# Altium project ECUV2.PrjPcb (part 1 of 3)
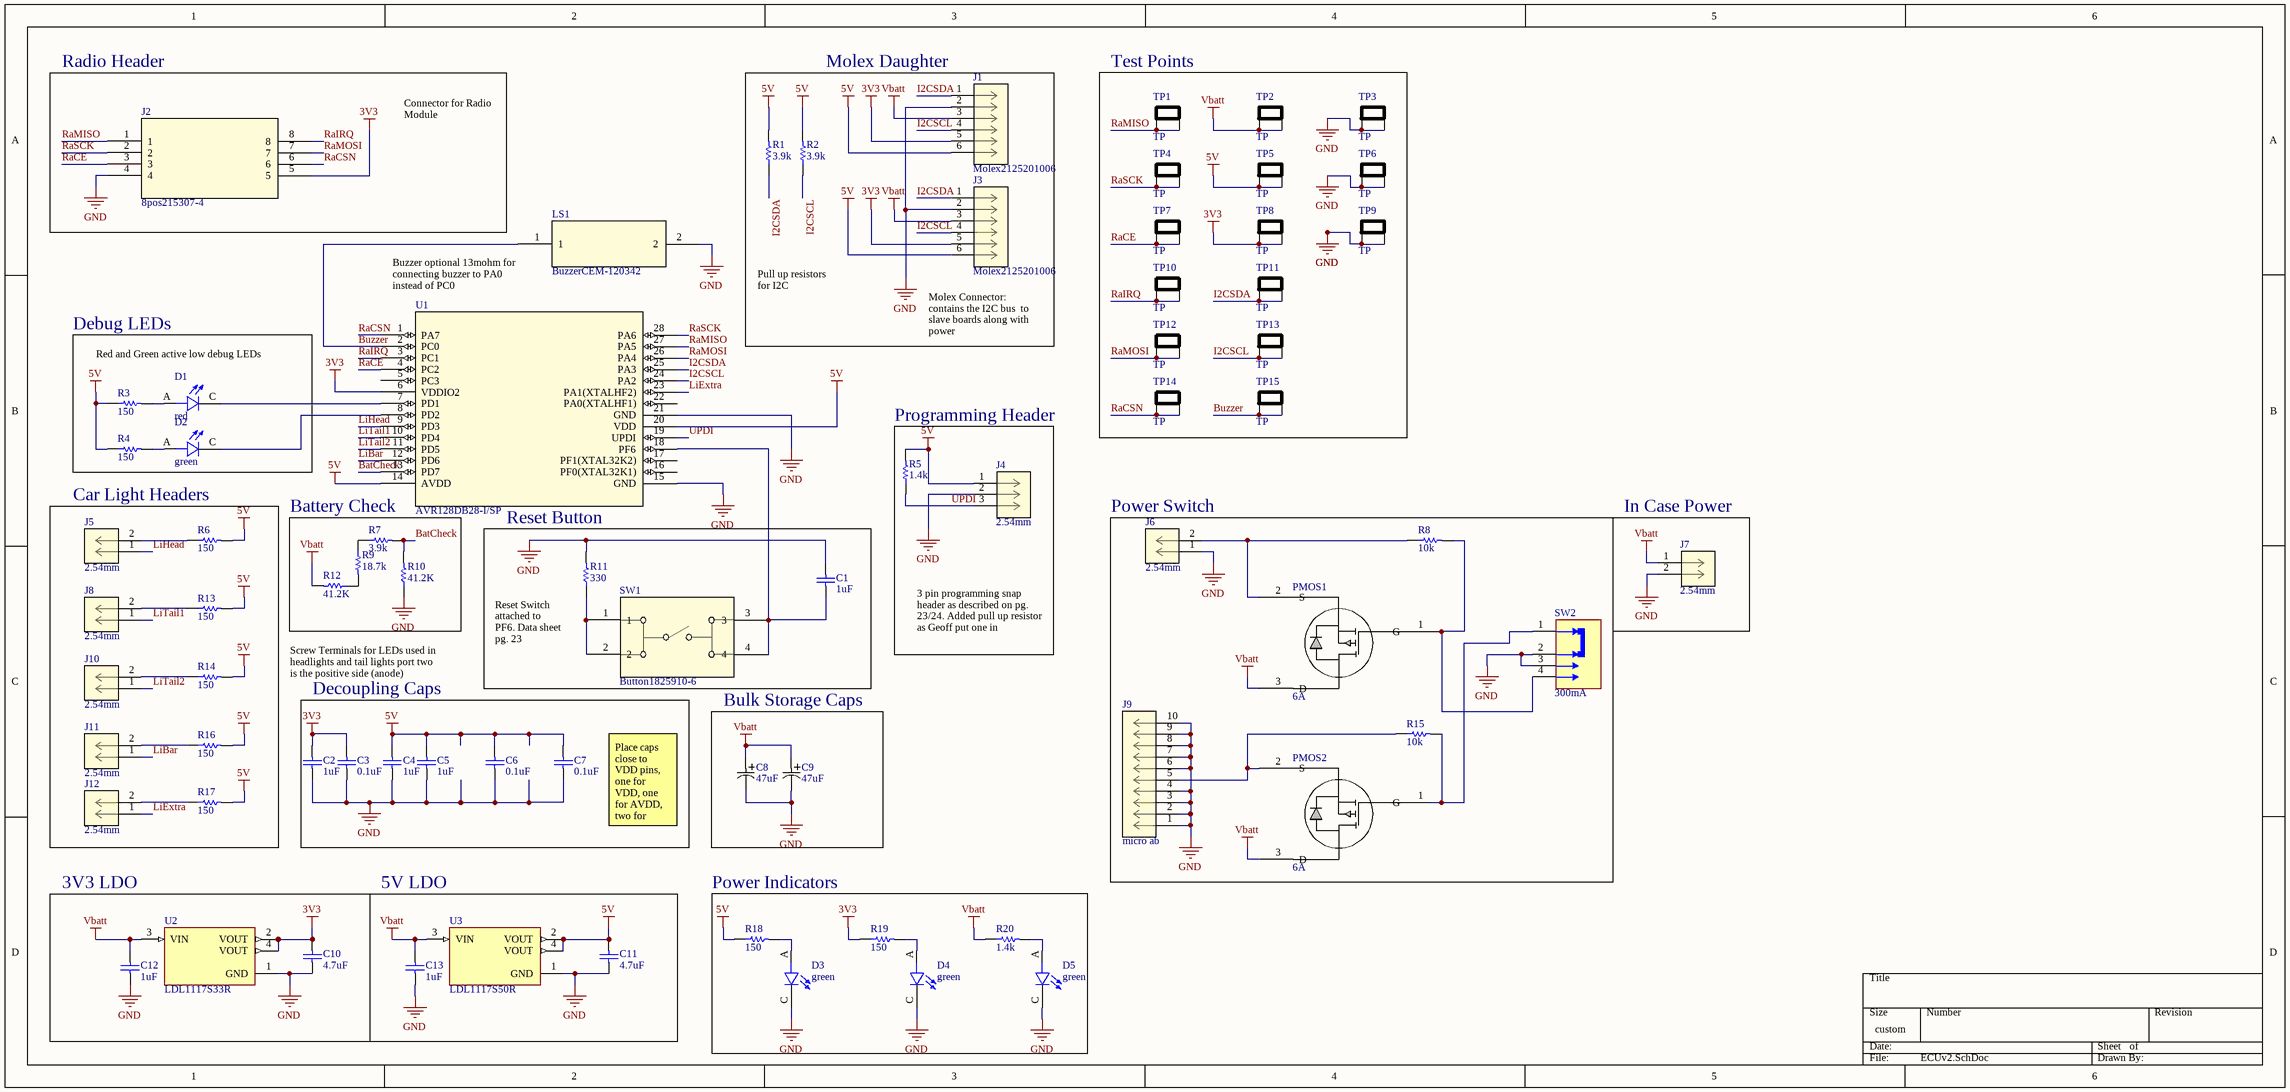
[diagram p0: ECUv2.SchDoc]
1 sheet, 73 parts. Net scope: global (net labels, ports and power ports of the same name join across sheets).
Board file: ECUv2.PcbDoc

## Sheet ECUv2.SchDoc
size 508 x 241 mm; SheetNumber: 1; SheetTotal: 1

### Parts
C1  1uF  [RES 0805]
C2  1uF  [RES 0805]
C3  0.1uF  [RES 0805]
C4  1uF  [RES 0805]
C5  1uF  [RES 0805]
C6  0.1uF  [RES 0805]
C7  0.1uF  [RES 0805]
C8  47uF  [CAP ELC 47uF]
C9  47uF  [CAP ELC 47uF]
C10  4.7uF  [RES 0805]
C11  4.7uF  [RES 0805]
C12  1uF  [RES 0805]
C13  1uF  [RES 0805]
D1  red  [0603LED]
D2  green  [0603LED]
D3  green  [0603LED]
D4  green  [0603LED]
D5  green  [0603LED]
J1  Molex2125201006  [Molex2125201006]
J2  8pos215307-4  [215307-4]
J3  Molex2125201006  [Molex2125201006]
J4  2.54mm  [HEAD 2.54mm 3pos]
J5  2.54mm  [CON screw 2pos 2.54mm]
J6  2.54mm  [CON screw 2pos 2.54mm]
J7  2.54mm  [CON screw 2pos 2.54mm]
J8  2.54mm  [CON screw 2pos 2.54mm]
J9  micro ab  [USB micro ab 0475900001]
J10  2.54mm  [CON screw 2pos 2.54mm]
J11  2.54mm  [CON screw 2pos 2.54mm]
J12  2.54mm  [CON screw 2pos 2.54mm]
LS1  BuzzerCEM-120342  [CEM-1203(42)]
PMOS1  6A  [SOT-23F MOS PMOS 30V 6A]
PMOS2  6A  [SOT-23F MOS PMOS 30V 6A]
R1  3.9k  [RES 0805]
R2  3.9k  [RES 0805]
R3  150  [RES 0805]
R4  150  [RES 0805]
R5  1.4k  [RES 0805]
R6  150  [RES 0805]
R7  3.9k  [RES 0805]
R8  10k  [RES 0805]
R9  18.7k  [RES 0805]
R10  41.2K  [RES 0805]
R11  330  [RES 0805]
R12  41.2K  [RES 0805]
R13  150  [RES 0805]
R14  150  [RES 0805]
R15  10k  [RES 0805]
R16  150  [RES 0805]
R17  150  [RES 0805]
R18  150  [RES 0805]
R19  150  [RES 0805]
R20  1.4k  [RES 0805]
SW1  Button1825910-6  [Button1825910-6]
SW2  300mA  [Switch On-On-On 300mA SLW-1277545-2A-RA-S-D]
TP1  TP  [RES 0805]
TP2  TP  [RES 0805]
TP3  TP  [RES 0805]
TP4  TP  [RES 0805]
TP5  TP  [RES 0805]
TP6  TP  [RES 0805]
TP7  TP  [RES 0805]
TP8  TP  [RES 0805]
TP9  TP  [RES 0805]
TP10  TP  [RES 0805]
TP11  TP  [RES 0805]
TP12  TP  [RES 0805]
TP13  TP  [RES 0805]
TP14  TP  [RES 0805]
TP15  TP  [RES 0805]
U1  AVR128DB28-I/SP  [AVR128DB28-ISP]
U2  LDL1117S33R  [SOT230P700X180-4N]
U3  LDL1117S50R  [SOT230P700X180-4N]

### Blocks framed on the sheet
Radio Header: J2
Molex Daughter: J1 J3 R1 R2
Test Points: TP1-TP15
Debug LEDs: D1 D2 R3 R4
Programming Header: J4 R5
Car Light Headers: J5 J8 J10-J12 R6 R13 R14 R16 R17
Battery Check: R7 R9 R10 R12
Reset Button: C1 R11 SW1
Power Switch: J6 J9 PMOS1 PMOS2 R8 R15 SW2
Decoupling Caps: C2-C7
Bulk Storage Caps: C8 C9
Power Indicators: D3-D5 R18-R20

### Nets
3V3: C2.2 C3.2 C10.2 J1.5 J2.5 J3.5 R19.1 TP8.1 TP8.2 U1.6(VDDIO2) U2.2(VOUT) U2.4(VOUT)
5V: C4.2 C5.1 C6.2 C7.2 C11.2 J1.6 J3.6 J4.1 R1.2 R2.2 R3.1 R4.1 R5.2 R6.2 R13.2 R14.2 R16.2 R17.2 R18.1 TP5.1 TP5.2 U1.14(AVDD) U1.20(VDD) U3.2(VOUT) U3.4(VOUT)
GND: C1.2 C2.1 C3.1 C4.1 C5.2 C6.1 C7.1 C8.2 C9.2 C10.1 C11.1 C12.1 C13.1 D3.C D4.C D5.C J1.2 J2.4 J3.2 J4.2 J6.1 J7.2 J9.1(VBUS) J9.2(D-) J9.3(D+) J9.4(ID) J9.6(SHIELD) J9.7(SHIELD) J9.8(SHIELD) J9.9(SHIELD) J9.10(SHIELD) LS1.2 R10.1 R11.2 SW2.2 SW2.3 TP3.1 TP3.2 TP6.1 TP6.2 TP9.1 TP9.2 U1.15(GND) U1.21(GND) U2.1(GND) U3.1(GND)
Vbatt: C8.1 C9.1 C12.2 C13.2 J1.3 J3.3 J7.1 PMOS1.3(D) PMOS2.3(D) R12.2 R20.1 TP2.1 TP2.2 U2.3(VIN) U3.3(VIN)
BatCheck: R7.2 R10.2 U1.13(PD7)
Buzzer: LS1.1 TP15.1 TP15.2 U1.2(PC0)
I2CSCL: J1.4 J3.4 R2.1 TP13.1 TP13.2 U1.24(PA2)
I2CSDA: J1.1 J3.1 R1.1 TP11.1 TP11.2 U1.25(PA3)
LiBar: J11.1 U1.12(PD6)
LiExtra: J12.1 U1.23(PA1(XTALHF2))
LiHead: J5.1 U1.9(PD3)
LiTail1: J8.1 U1.10(PD4)
LiTail2: J10.1 U1.11(PD5)
RaCE: J2.3 TP7.1 TP7.2 U1.4(PC2)
RaCSN: J2.6 TP14.1 TP14.2 U1.1(PA7)
RaIRQ: J2.8 TP10.1 TP10.2 U1.3(PC1)
RaMISO: J2.1 TP1.1 TP1.2 U1.27(PA5)
RaMOSI: J2.7 TP12.1 TP12.2 U1.26(PA4)
RaSCK: J2.2 TP4.1 TP4.2 U1.28(PA6)
UPDI: J4.3 R5.1 U1.19(UPDI)
NetC1_1: C1.1 SW1.3 SW1.4 U1.18(PF6)
NetD1_A: D1.A R3.2
NetD1_C: D1.C U1.7(PD1)
NetD2_A: D2.A R4.2
NetD2_C: D2.C U1.8(PD2)
NetD3_A: D3.A R18.2
NetD4_A: D4.A R19.2
NetD5_A: D5.A R20.2
NetJ5_2: J5.2 R6.1
NetJ6_2: J6.2 PMOS1.2(S) R8.1
NetJ8_2: J8.2 R13.1
NetJ9_5: J9.5(GND) PMOS2.2(S) R15.1
NetJ10_2: J10.2 R14.1
NetJ11_2: J11.2 R16.1
NetJ12_2: J12.2 R17.1
NetPMOS1_1: PMOS1.1(G) R8.2 SW2.4
NetPMOS2_1: PMOS2.1(G) R15.2 SW2.1
NetR7_1: R7.1 R9.1
NetR9_2: R9.2 R12.1
NetR11_1: R11.1 SW1.1 SW1.2

Not connected (* = marked no-connect by the designer): U1 5(PC3) 16(PF0(XTAL32K1)) 17(PF1(XTAL32K2)) 22(PA0(XTALHF1))

### Notes on the sheet
- Connector for Radio Module
- Buzzer optional 13mohm for connecting buzzer to PA0 instead of PC0
- Red and Green active low debug LEDs
- Pull up resistors for I2C
- (near J3) Molex Connector: contains the I2C bus  to slave boards along with power
- In Case Power
- 3 pin programming snap header as described on pg. 23/24. Added pull up resistor as Geoff put one in
- Screw Terminals for LEDs used in headlights and tail lights port two is the positive side (anode)
- (near R11) Reset Switch attached to PF6. Data sheet pg. 23
- Place caps close to VDD pins, one for VDD, one for AVDD, two for program header
- 3V3 LDO
- 5V LDO